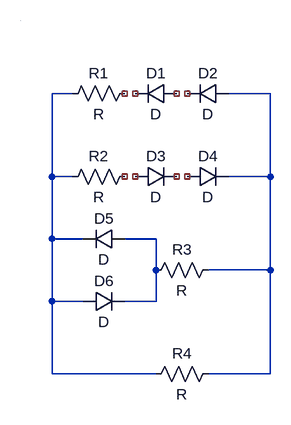
[diagram p0: schematic Draft1.asc]
Draft1.asc, the LTspice schematic file:
Version 4
SHEET 1 880 680
WIRE 80 112 48 112
WIRE 384 112 320 112
WIRE 48 240 48 112
WIRE 80 240 48 240
WIRE 384 240 384 112
WIRE 384 240 320 240
WIRE 48 336 48 240
WIRE 96 336 48 336
WIRE 208 336 160 336
WIRE 208 384 208 336
WIRE 384 384 384 240
WIRE 384 384 288 384
WIRE 48 432 48 336
WIRE 96 432 48 432
WIRE 208 432 208 384
WIRE 208 432 160 432
WIRE 48 544 48 432
WIRE 208 544 48 544
WIRE 384 544 384 384
WIRE 384 544 288 544
WIRE 0 0 0 0
SYMBOL res 176 96 R90
WINDOW 0 0 56 VBottom 2
WINDOW 3 32 56 VTop 2
SYMATTR InstName R1
SYMBOL diode 240 96 R90
WINDOW 0 0 32 VBottom 2
WINDOW 3 32 32 VTop 2
SYMATTR InstName D1
SYMBOL diode 320 96 R90
WINDOW 0 0 32 VBottom 2
WINDOW 3 32 32 VTop 2
SYMATTR InstName D2
SYMBOL diode 176 256 R270
WINDOW 0 32 32 VTop 2
WINDOW 3 0 32 VBottom 2
SYMATTR InstName D3
SYMBOL diode 256 256 R270
WINDOW 0 32 32 VTop 2
WINDOW 3 0 32 VBottom 2
SYMATTR InstName D4
SYMBOL res 176 224 R90
WINDOW 0 0 56 VBottom 2
WINDOW 3 32 56 VTop 2
SYMATTR InstName R2
SYMBOL diode 160 320 R90
WINDOW 0 0 32 VBottom 2
WINDOW 3 32 32 VTop 2
SYMATTR InstName D5
SYMBOL diode 96 448 R270
WINDOW 0 32 32 VTop 2
WINDOW 3 0 32 VBottom 2
SYMATTR InstName D6
SYMBOL res 304 368 R90
WINDOW 0 0 56 VBottom 2
WINDOW 3 32 56 VTop 2
SYMATTR InstName R3
SYMBOL res 304 528 R90
WINDOW 0 0 56 VBottom 2
WINDOW 3 32 56 VTop 2
SYMATTR InstName R4

The netlist it stands for:
* Draft1.asc
R1 NC_01 N001 R
D1 NC_02 NC_03 D
D2 N002 NC_04 D
D3 NC_05 NC_06 D
D4 NC_07 N002 D
R2 NC_08 N001 R
D5 N003 N001 D
D6 N001 N003 D
R3 N002 N003 R
R4 N002 N001 R
.model D D
.lib standard.dio
.backanno
.end